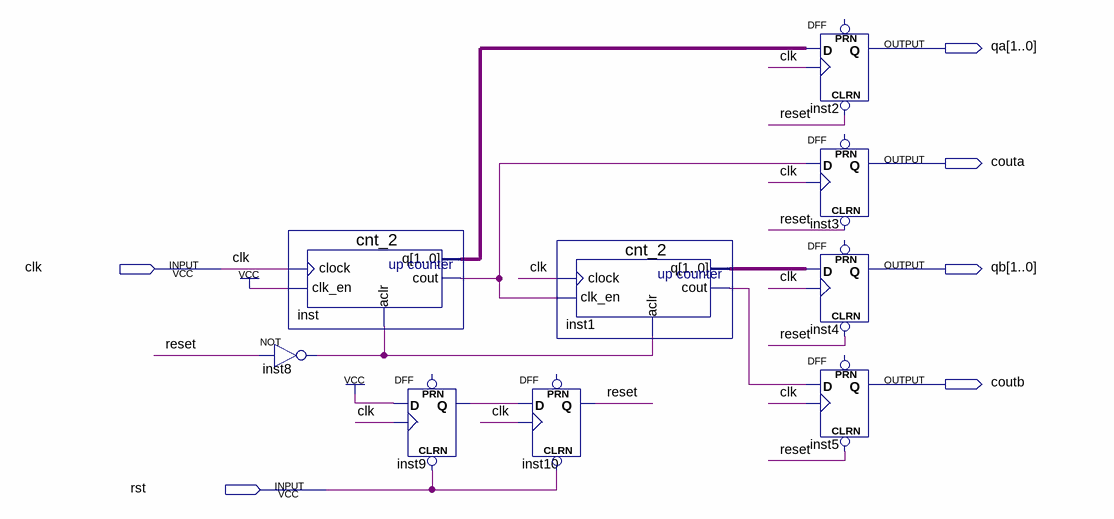
[diagram p0: schematic sheet]
// Quartus schematic lab4_right.bdf as structural Verilog: 9 symbols, 6 pins
module lab4_right (
  input  clk,
  input  rst,
  output [1:0] qa,
  output couta,
  output [1:0] qb,
  output coutb
);

  wire inst1_cout, inst8_out, inst9_q, inst_cout, reset;
  wire [1:0] inst1_q, inst_q;

  cnt_2 inst (.clock(clk), .clk_en(1'b1), .aclr(inst8_out), .cout(inst_cout), .q(inst_q));
  not inst8 (inst8_out, reset);
  DFF inst9 (.CLRN(rst), .CLK(clk), .D(1'b1), .Q(inst9_q));  // open: PRN
  DFF inst10 (.CLRN(rst), .CLK(clk), .D(inst9_q), .Q(reset));  // open: PRN
  cnt_2 inst1 (.clock(clk), .clk_en(inst_cout), .aclr(inst8_out), .cout(inst1_cout), .q(inst1_q));
  DFF inst2[1:0] (.CLRN(reset), .CLK(clk), .D(inst_q), .Q(qa));  // open: PRN
  DFF inst3 (.CLRN(reset), .CLK(clk), .D(inst_cout), .Q(couta));  // open: PRN
  DFF inst4[1:0] (.CLRN(reset), .CLK(clk), .D(inst1_q), .Q(qb));  // open: PRN
  DFF inst5 (.CLRN(reset), .CLK(clk), .D(inst1_cout), .Q(coutb));  // open: PRN
endmodule
